# EAGLE design AstroEQ Arduino Mega (EAGLE 6.6.0)
REVISION: V4.8
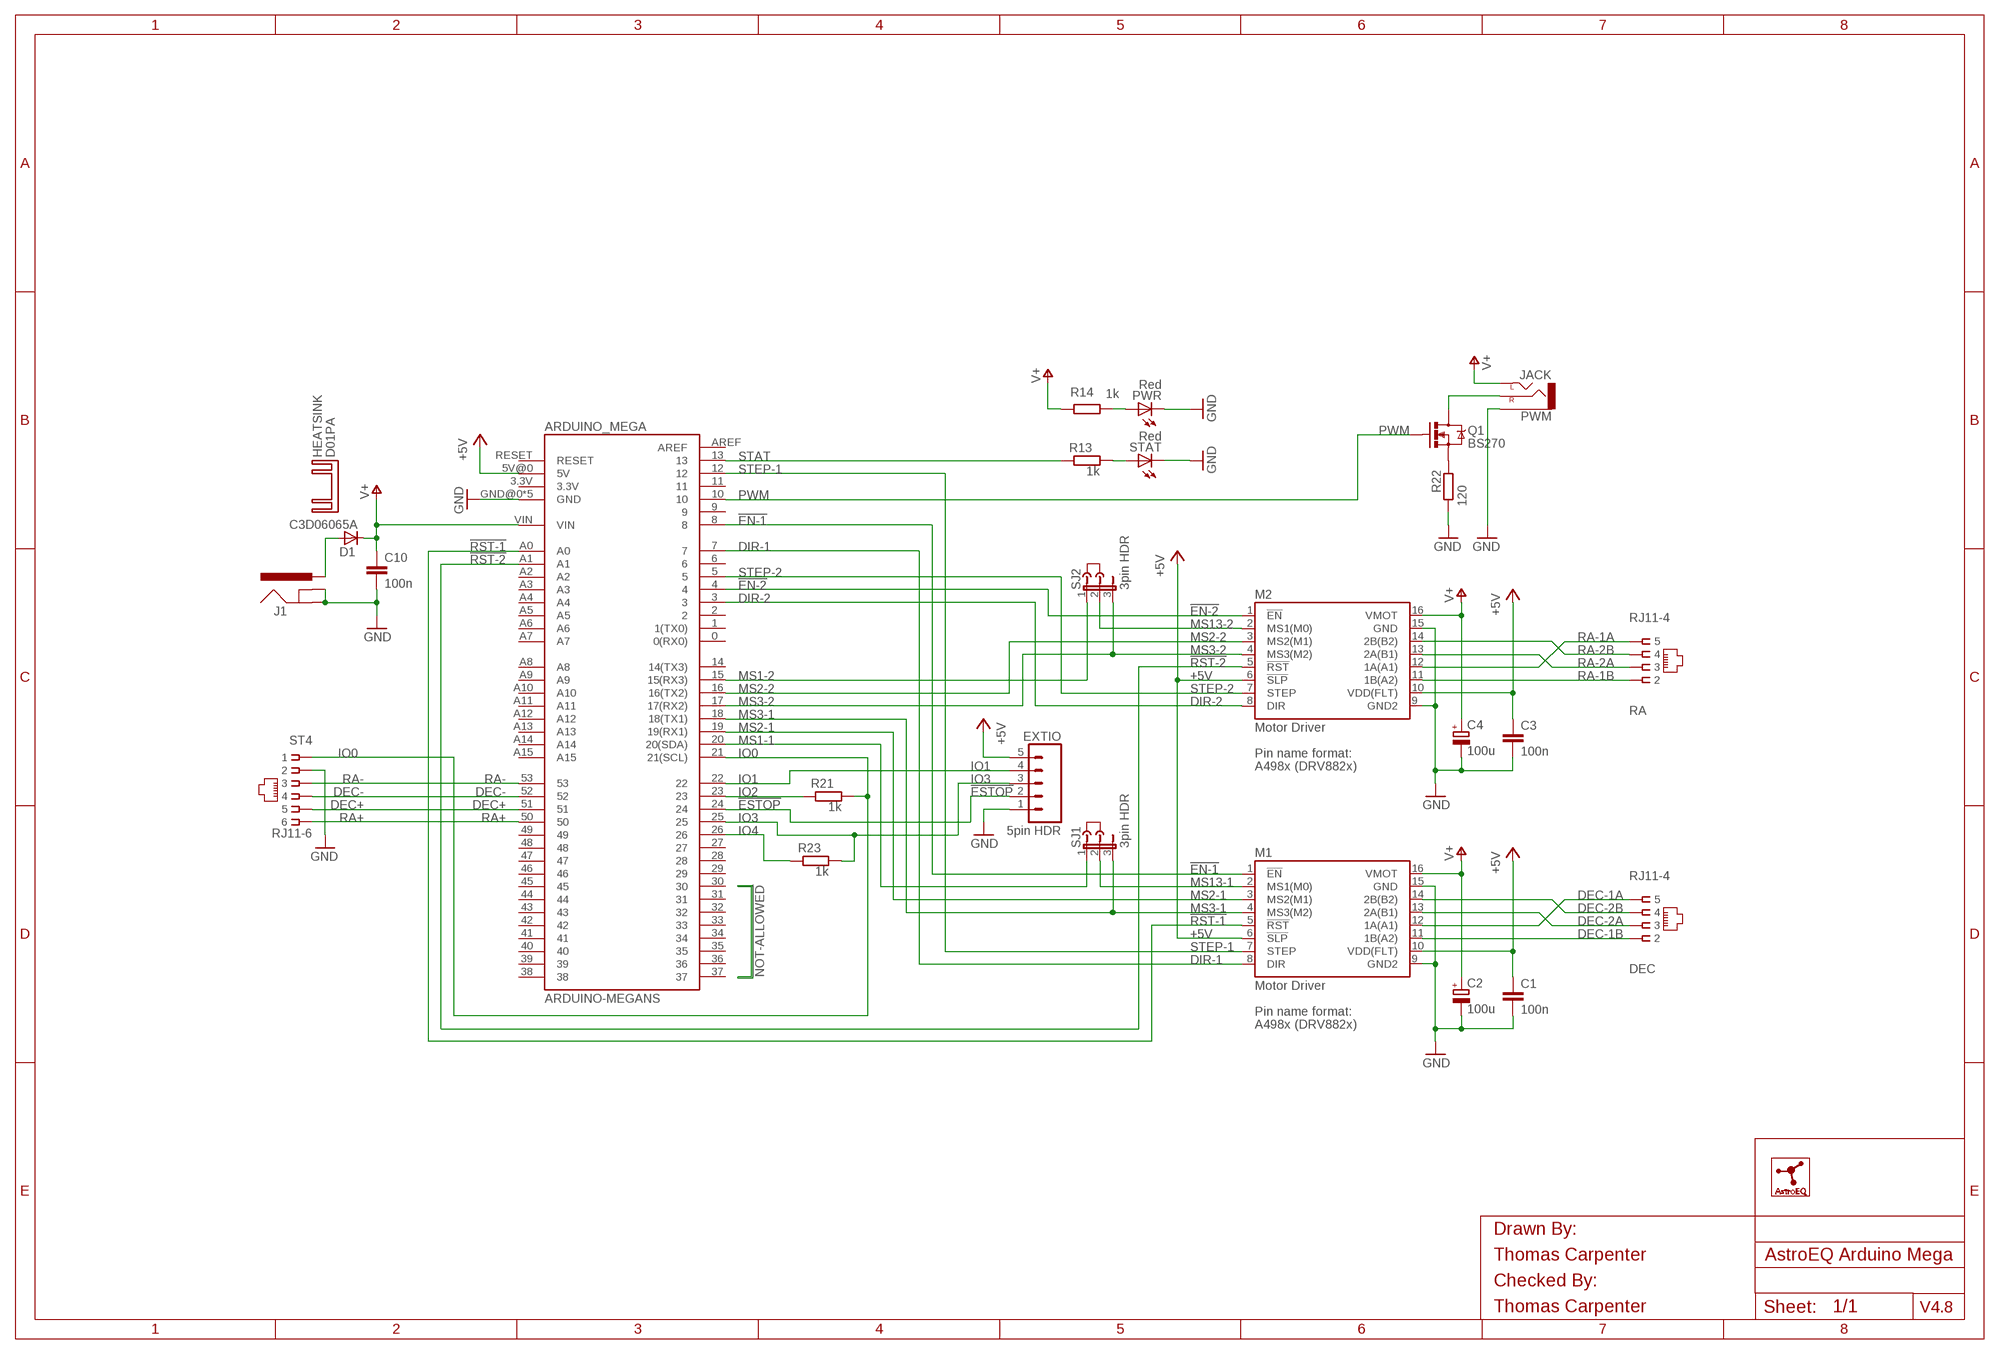
[diagram p0: schematic, sheet 1]
FRAME1 (A3L-LOC): CHECKED_BY: Thomas Carpenter; DRAWN_BY: Thomas Carpenter

## Parts
ARDUINO_MEGA  ARDUINO-MEGANS  [ARDUINO_MEGA_NS]
C1  100n  C-EU025-024X044  [C025-024X044]
C2  100u  CPOL-EUE2.5-7  [E2,5-7]
C3  100n  C-EU025-024X044  [C025-024X044]
C4  100u  CPOL-EUE2.5-7  [E2,5-7]
C10  100n  C-EU025-024X044  [C025-024X044]
D1  C3D06065A  MUR820VERT  [TO220ACS]
DEC  RJ11-4  [RJ11-NO_SHIELD-4]
EXTIO  5pin HDR  M05PTH  [1X05]
HEATSINK  D01PA  [D01PA]
J1  POWER_JACKPTH  [POWER_JACK_PTH]
J2  DNI  JUMPER  [JUMP]
J3  DNI  JUMPER  [JUMP]
LOGO1  ASTROEQ8MM  [ASTROEQ]
M1  Motor Driver  A4983CARRIER  [DIP16-W]
M2  Motor Driver  A4983CARRIER  [DIP16-W]
PWM  JACK  AUDIO-JACKVERT  [AUDIO-JACK-3.5MM-VERT]
PWR  Red  LED3MM  [LED3MM]
Q1  BS270  MOSFET-NCHANNELPTH  [TO-92]
R13  1k  R-EU_0204/5  [0204/5]
R14  1k  R-EU_0204/7  [0204/7]
R21  1k  R-EU_0204/7  [0204/7]
R22  120  R-EU_0204/7  [0204/7]
R23  1k  R-EU_0204/7  [0204/7]
RA  RJ11-4  [RJ11-NO_SHIELD-4]
SJ1  3pin HDR  JP2E  [JP2]
SJ2  3pin HDR  JP2E  [JP2]
ST4  RJ11-6  RJ11-2L-B  [RJ11-NO_SHIELD]
STAT  Red  LED3MM  [LED3MM]

## Nets
!EN-1: ARDUINO_MEGA.8 M1.1(!EN)
!EN-2: ARDUINO_MEGA.4 M2.1(!EN)
!ESTOP: ARDUINO_MEGA.24 EXTIO.2
!RST-1: ARDUINO_MEGA.A0 M1.5(!RST)
!RST-2: ARDUINO_MEGA.A1 M2.5(!RST)
+5V: ARDUINO_MEGA.5V@0(5V) C1.1 C3.1 EXTIO.5 M1.6(!SLP) M1.10(VDD(FLT)) M2.6(!SLP) M2.10(VDD(FLT))
DEC+: ARDUINO_MEGA.51 ST4.5
DEC-: ARDUINO_MEGA.52 ST4.4
DEC-1A: DEC.5 M1.12(1A(A1))
DEC-1B: DEC.2 M1.11(1B(A2))
DEC-2A: DEC.3 M1.13(2A(B1))
DEC-2B: DEC.4 M1.14(2B(B2))
DIR-1: ARDUINO_MEGA.7 M1.8(DIR)
DIR-2: ARDUINO_MEGA.3 M2.8(DIR)
GND: ARDUINO_MEGA.GND@0(GND) ARDUINO_MEGA.GND@1(GND) ARDUINO_MEGA.GND@2(GND) ARDUINO_MEGA.GND@3(GND) ARDUINO_MEGA.GND@4(GND) C1.2 C2.- C3.2 C4.- C10.2 EXTIO.1 J1.GND J1.GNDBREAK M1.9(GND2) M1.15(GND) M2.9(GND2) M2.15(GND) PWM.1(SLEEVE) PWR.K(C) R22.1 ST4.2 STAT.K(C)
IO0: ARDUINO_MEGA.21(21(SCL)) R21.2 ST4.1
IO1: ARDUINO_MEGA.22 EXTIO.4
IO2: ARDUINO_MEGA.23 R21.1
IO3: ARDUINO_MEGA.25 EXTIO.3 R23.2
IO4: ARDUINO_MEGA.26 R23.1
MS1-1: ARDUINO_MEGA.20(20(SDA)) SJ1.1
MS1-2: ARDUINO_MEGA.15(15(RX3)) SJ2.1
MS2-1: ARDUINO_MEGA.19(19(RX1)) M1.3(MS2(M1))
MS2-2: ARDUINO_MEGA.16(16(TX2)) M2.3(MS2(M1))
MS3-1: ARDUINO_MEGA.18(18(TX1)) M1.4(MS3(M2)) SJ1.3
MS3-2: ARDUINO_MEGA.17(17(RX2)) M2.4(MS3(M2)) SJ2.3
MS13-1: M1.2(MS1(M0)) SJ1.2
MS13-2: M2.2(MS1(M0)) SJ2.2
PWM: ARDUINO_MEGA.10 Q1.2(G)
PWM-ILIM: Q1.3(S) R22.2
PWM-OUT: PWM.3(RIGHT) Q1.1(D)
PWRLED: PWR.A R14.2
RA+: ARDUINO_MEGA.50 ST4.6
RA-: ARDUINO_MEGA.53 ST4.3
RA-1A: M2.12(1A(A1)) RA.5
RA-1B: M2.11(1B(A2)) RA.2
RA-2A: M2.13(2A(B1)) RA.3
RA-2B: M2.14(2B(B2)) RA.4
STAT: ARDUINO_MEGA.13 R13.1
STATLED: R13.2 STAT.A
STEP-1: ARDUINO_MEGA.12 M1.7(STEP)
STEP-2: ARDUINO_MEGA.5 M2.7(STEP)
V+: ARDUINO_MEGA.VIN C2.+ C4.+ C10.1 D1.C M1.16(VMOT) M2.16(VMOT) PWM.2(LEFT) R14.1
VIN: D1.A J1.PWR
Unconnected: ARDUINO_MEGA.0(0(RX0)) ARDUINO_MEGA.1(1(TX0)) ARDUINO_MEGA.2 ARDUINO_MEGA.3.3V ARDUINO_MEGA.6 ARDUINO_MEGA.9 ARDUINO_MEGA.11 ARDUINO_MEGA.14(14(TX3)) ARDUINO_MEGA.27 ARDUINO_MEGA.28 ARDUINO_MEGA.29 ARDUINO_MEGA.30 ARDUINO_MEGA.31 ARDUINO_MEGA.32 ARDUINO_MEGA.33 ARDUINO_MEGA.34 ARDUINO_MEGA.35 ARDUINO_MEGA.36 ARDUINO_MEGA.37 ARDUINO_MEGA.38 ARDUINO_MEGA.39 ARDUINO_MEGA.40 ARDUINO_MEGA.41 ARDUINO_MEGA.42 ARDUINO_MEGA.43 ARDUINO_MEGA.44 ARDUINO_MEGA.45 ARDUINO_MEGA.46 ARDUINO_MEGA.47 ARDUINO_MEGA.48 ARDUINO_MEGA.49 ARDUINO_MEGA.A2 ARDUINO_MEGA.A3 ARDUINO_MEGA.A4 ARDUINO_MEGA.A5 ARDUINO_MEGA.A6 ARDUINO_MEGA.A7 ARDUINO_MEGA.A8 ARDUINO_MEGA.A9 ARDUINO_MEGA.A10 ARDUINO_MEGA.A11 ARDUINO_MEGA.A12 ARDUINO_MEGA.A13 ARDUINO_MEGA.A14 ARDUINO_MEGA.A15 ARDUINO_MEGA.AREF ARDUINO_MEGA.RESET

## Library data of the parts
ARDUINO_MEGA = SparkFun:ARDUINO-MEGA: Arduino Mega footprint connections
C1 C3 C10 = resistor:C-EU: CAPACITOR, European symbol; MF: AVX; MPN: SR205C104KAR; OC_FARNELL: 1100367
C2 C4 = resistor:CPOL-EU: POLARIZED CAPACITOR, European symbol; MF: MULTICOMP; MPN: MCGPR25V107M6.3X11; OC_FARNELL: 9451188
D1 = diode:MUR820: DIODE; MF: CREE; MPN: C3D06065A; OC_FARNELL: 1864928
DEC RA = con-tycoelectronics:RJ11-4; MF: MOLEX; MPN: 95501-2641; OC_FARNELL: 1560166
EXTIO = SparkFun:M05: Header 5 Standard 5-pin 0.1" header. Use with straight break away headers (SKU : PRT-00116), right angle break away headers (PRT-00553), swiss pins (PRT-00743), machine pins (PRT-00117), and female headers (PRT-00115). Molex polarized connector foot print use with SKU : PRT-08230 with associated crimp pins and housings.; OC_FARNELL: unknown
HEATSINK = heatsink:D01PA: HEATSINK distributor Schukat
J1 = SparkFun:POWER_JACK: Power Jack This is the standard 5.5mm barrel jack for power. The PTH is the most common, proven, reliable, footprint. All others are experimental. The Slot footprint only works if the mill layer is transmitted to the PCB fab house so be warned. Spark Fun Electronics SKU : PRT-00119. Mating wall wart : TOL-00298 (and others); MF: MULTICOMP; MPN: MJ-179PH; OC_FARNELL: 1737246
J2 J3 = jumper:JUMPER: JUMPER header; MF: 3M; MPN: 969102-0000-DA; OC_FARNELL: 2579814
LOGO1 = CompanyLogos:ASTROEQ
M1 M2 = A4983Carrier:A4983CARRIER; MF: SAMTEC; MPN: CES-116-01-T-S; OC_FARNELL: 1667522
PWM = SparkFun:AUDIO-JACK: 3.5mm Audio Jack Simple 3.5mm common PCB mount audio jack. SKU: PRT-08032; MANUFACTURER: LUMBERG; MF: CLIFF ELECTRONIC COMPONENTS; MPN: 1502 01; OC_FARNELL: 1243242
PWR STAT = led:LED: LED OSRAM: - CHIPLED LG R971, LG N971, LY N971, LG Q971, LY Q971, LO R971, LY R971 LH N974, LH R974 LS Q976, LO Q976, LY Q976 LO Q996 - Hyper CHIPLED LW Q18S LB Q993, LB Q99A, LB R99A - SideLED LS A670, LO A670, LY A670, LG A670, LP A670 LB A673, LV A673, LT A673, LW A673 LH A674 LY A675 LS A676, LA A676, LO A676, LY A676, LW A676 LS A679, LY A679, LG A679 - Hyper Micro SIDELED® LS Y876, LA Y876, LO Y876, LY Y876 LT Y87S - SmartLED LW L88C, LW L88S LB L89C, LB L89S, LG L890 LS L89K, LO L89K, LY L89K LS L896, LA L896, LO L896, LY L896 - TOPLED LS T670, LO T670, LY T670, LG T670, LP T670 LSG T670, LSP T670, LSY T670, LOP T670, LYG T670 LG T671, LOG T671, LSG T671 LB T673, LV T673, LT T673, LW T673 LH T674 LS T676, LA T676, LO T676, LY T676, LB T676, LH T676, LSB T676, LW T676 LB T67C, LV T67C, LT T67C, LS T67K, LO T67K, LY T67K, LW E67C LS E67B, LA E67B, LO E67B, LY E67B, LB E67C, LV E67C, LT E67C LW T67C LS T679, LY T679, LG T679 LS T770, LO T770, LY T770, LG T770, LP T770 LB T773, LV T773, LT T773, LW T773 LH T774 LS E675, LA E675, LY E675, LS T675 LS T776, LA T776, LO T776, LY T776, LB T776 LHGB T686 LT T68C, LB T68C - Hyper Mini TOPLED® LB M676 - Mini TOPLED Santana® LG M470 LS M47K, LO M47K, LY M47K Source: http://www.osram.convergy.de LUXEON: - LUMILED® LXK2-PW12-R00, LXK2-PW12-S00, LXK2-PW14-U00, LXK2-PW14-V00 LXK2-PM12-R00, LXK2-PM12-S00, LXK2-PM14-U00 LXK2-PE12-Q00, LXK2-PE12-R00, LXK2-PE12-S00, LXK2-PE14-T00, LXK2-PE14-U00 LXK2-PB12-K00, LXK2-PB12-L00, LXK2-PB12-M00, LXK2-PB14-N00, LXK2-PB14-P00, LXK2-PB14-Q00 LXK2-PR12-L00, LXK2-PR12-M00, LXK2-PR14-Q00, LXK2-PR14-R00 LXK2-PD12-Q00, LXK2-PD12-R00, LXK2-PD12-S00 LXK2-PH12-R00, LXK2-PH12-S00 LXK2-PL12-P00, LXK2-PL12-Q00, LXK2-PL12-R00 Source: www.luxeon.com KINGBRIGHT: KA-3528ASYC Source: www.kingbright.com; MF: KINGBRIGHT; MPN: L-424HDT; OC_FARNELL: 1142499
Q1 = SparkFun:MOSFET-NCHANNEL; MF: FAIRCHILD SEMICONDUCTOR; MPN: BS270; OC_FARNELL: 1017689
R13 R14 R21 R23 = rcl:R-EU_: RESISTOR, European symbol; MF: MULTICOMP; MPN: MF12 1K; OC_FARNELL: 9342400
R22 = rcl:R-EU_: RESISTOR, European symbol; MF: MULTICOMP; MPN: MF12 120R; OC_FARNELL: 9342516
SJ1 SJ2 = jumper:JP2E: JUMPER; MF: HARWIN; MPN: M20-9990345.; OC_FARNELL: 1022248
ST4 = con-tycoelectronics:RJ11: CORCOM Modular RJ Jacks No Shield Source: www.tycoelectronics.com .. ENG_DS_1654001_1099_RJ_L_0507.pdf; MF: TYCO ELECTRONICS; MPN: RJ11-2L-B; OC_FARNELL: unknown; OC_NEWARK: 83F4463

## Net classes
1 power: width 0.61 mm, drill 0.711 mm, clearance 0.203 mm
2 gnd: width 0.305 mm, drill 0.711 mm, clearance 0.203 mm
3 usbvcc: width 0.508 mm, drill 0.711 mm, clearance 0.203 mm

## Board
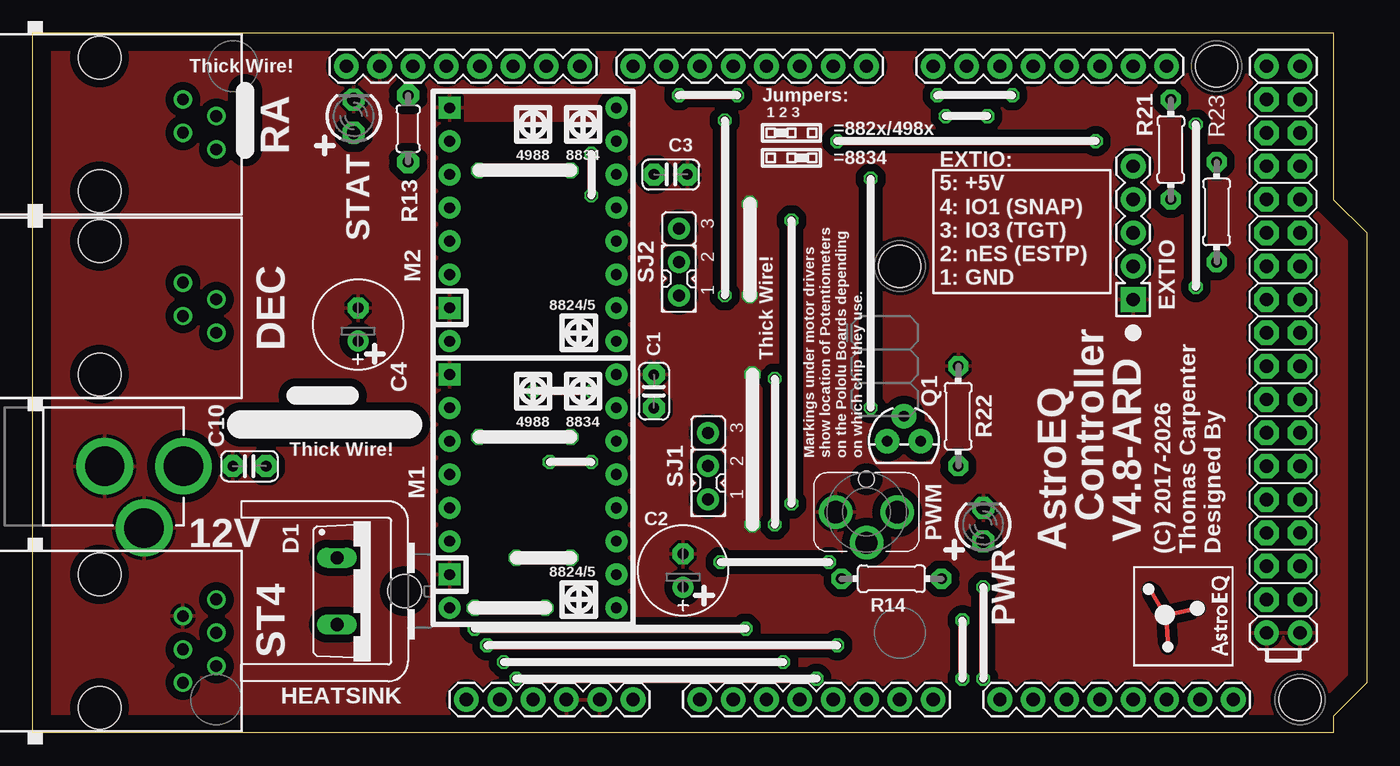
[diagram p1: board, top side]
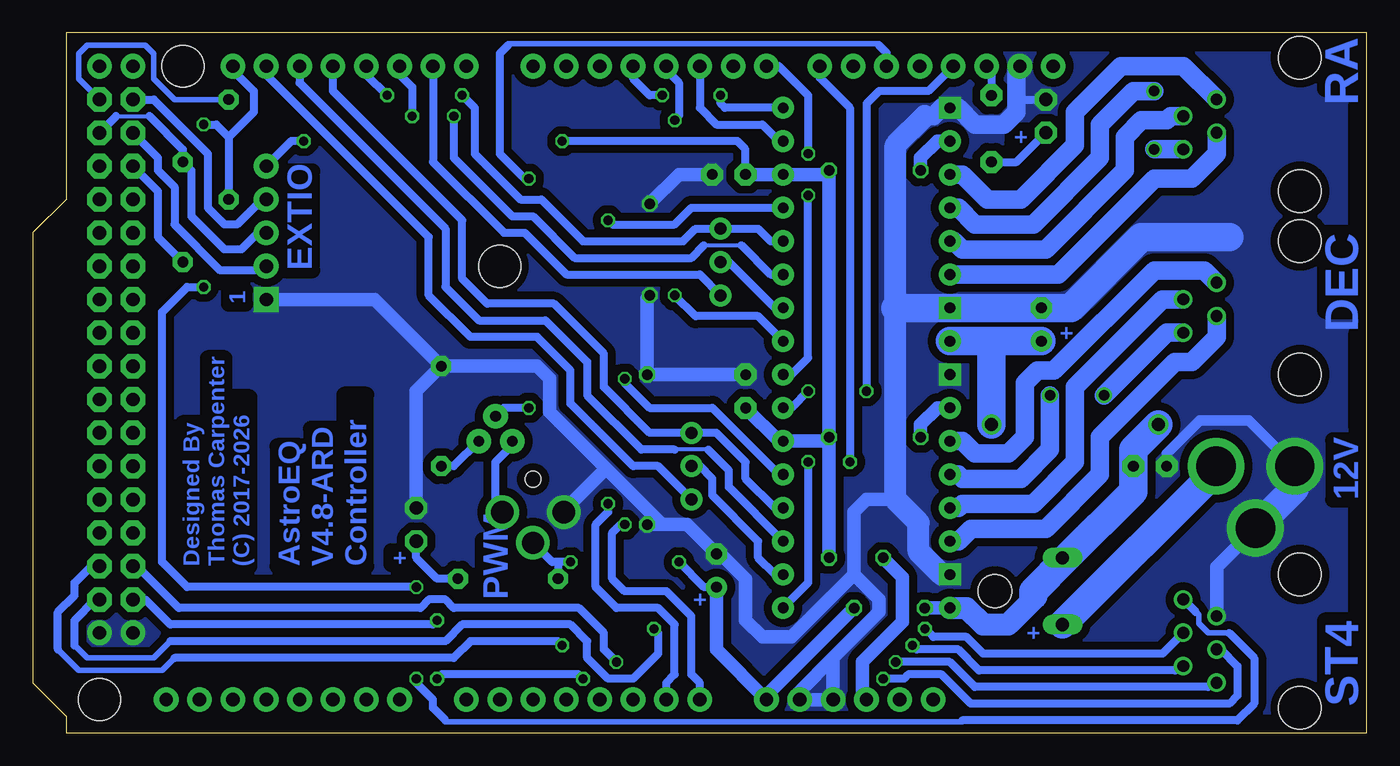
[diagram p2: board, bottom side, seen from below]

Size 101.6 x 53.34 mm. Coordinates in mm from the lower left corner, seen from the top.
Copper layers (1*16): Top 0.035mm / dielectric 1.5mm / Bottom 0.035mm
Design rules "default *": minimum track width 6mil, minimum drill 12mil, track to track 6mil, track to pad 6mil, pad to pad 6mil, via to via 6mil, smd to smd 0mil, copper to edge 12mil, drill to drill 10mil, minimum pad ring 10mil, minimum via ring 6mil, stop-mask expansion 2mil, vias tented up to drill 1mm, thermal gap 10mil
Holes 3.2 mm at 90.17,50.8 66.04,35.56 96.52,2.54
tRestrict: 8 lines
bRestrict: 10 lines

### Footprints (pad centres in the part's own frame; a part is rotated, then mirrored left to right if it is on the bottom)
ARDUINO_MEGA_NS = drill 1.016 pad 1.88: 0 63.5,50.8; 1 60.96,50.8; 2 58.42,50.8; 3 55.88,50.8; 3.3V 35.56,2.54; 4 53.34,50.8; 5 50.8,50.8; 5V@0 38.1,2.54; 5V@1 93.98,50.8; 5V@2 96.52,50.8; 6 48.26,50.8; 7 45.72,50.8; 8 41.656,50.8; 9 39.116,50.8; 10 36.576,50.8; 11 34.036,50.8; 12 31.496,50.8; 13 28.956,50.8; 14 68.58,50.8; 15 71.12,50.8; 16 73.66,50.8; 17 76.2,50.8; 18 78.74,50.8; 19 81.28,50.8; 20 83.82,50.8; 21 86.36,50.8; A0 50.8,2.54; A1 53.34,2.54; A2 55.88,2.54; A3 58.42,2.54; A4 60.96,2.54; A5 63.5,2.54; A6 66.04,2.54; A7 68.58,2.54; A8 73.66,2.54; A9 76.2,2.54; A10 78.74,2.54; A11 81.28,2.54; A12 83.82,2.54; A13 86.36,2.54; A14 88.9,2.54; A15 91.44,2.54; AREF 23.876,50.8; GND@0 40.64,2.54; GND@1 43.18,2.54; GND@2 93.98,7.62; GND@3 96.52,7.62; GND@4 26.416,50.8; RESET 33.02,2.54; VIN 45.72,2.54 | drill 1.016 pad 1.88 octagon: 22 93.98,48.26; 23 96.52,48.26; 24 93.98,45.72; 25 96.52,45.72; 26 93.98,43.18; 27 96.52,43.18; 28 93.98,40.64; 29 96.52,40.64; 30 93.98,38.1; 31 96.52,38.1; 32 93.98,35.56; 33 96.52,35.56; 34 93.98,33.02; 35 96.52,33.02; 36 93.98,30.48; 37 96.52,30.48; 38 93.98,27.94; 39 96.52,27.94; 40 93.98,25.4; 41 96.52,25.4; 42 93.98,22.86; 43 96.52,22.86; 44 93.98,20.32; 45 96.52,20.32; 46 93.98,17.78; 47 96.52,17.78; 48 93.98,15.24; 49 96.52,15.24; 50 93.98,12.7; 51 96.52,12.7; 52 93.98,10.16; 53 96.52,10.16
C025-024X044 = drill 0.813 pad 1.676 octagon: 1 -1.27,0; 2 1.27,0
E2,5-7 = drill 0.813 pad 1.6: + -1.27,0 | drill 0.813 pad 1.6 octagon: - 1.27,0
TO220ACS = drill 1.016 long: A 2.54,-2.54; C -2.54,-2.54
RJ11-NO_SHIELD-4 = drill 0.9 pad 1.4: 2 -1.905,6.35; 3 -0.635,8.89; 4 0.635,6.35; 5 1.905,8.89 | hole 3.251: -5.08,0; 5.08,0
1X05 = drill 1.016 pad 1.88 square: 1 -5.08,0 | drill 1.016 pad 1.88: 2 -2.54,0; 3 0,0; 4 2.54,0; 5 5.08,0
D01PA = hole 2.54: 0,-1.016
POWER_JACK_PTH = drill 2.997 pad 4.318: GND 0,7.7; GNDBREAK 4.7,10.7; PWR 0,13.7
DIP16-W = drill 0.813 pad 1.676: 1 -8.89,-6.35; 2 -6.35,-6.35; 3 -3.81,-6.35; 4 -1.27,-6.35; 5 1.27,-6.35; 6 3.81,-6.35; 7 6.35,-6.35; 8 8.89,-6.35; 10 6.35,6.35; 11 3.81,6.35; 12 1.27,6.35; 13 -1.27,6.35; 14 -3.81,6.35; 16 -8.89,6.35 | drill 0.813 pad 1.676 square: 9 8.89,6.35; 15 -6.35,6.35
AUDIO-JACK-3.5MM-VERT = drill 1.7: 1 2.35,0; 2 0,2.35; 3 -2.35,0 | hole 1.2: 0,-2.5
LED3MM = drill 1 pad 1.676 octagon: A -1.27,0; K 1.27,0
TO-92 = drill 0.813 pad 1.88: 1 -1.27,0; 2 0,1.905; 3 1.27,0
0204/5 = drill 0.813 pad 1.676 octagon: 1 -2.54,0; 2 2.54,0
0204/7 = drill 0.813 pad 1.524 octagon: 1 -3.81,0; 2 3.81,0
JP2 = drill 0.914 pad 1.676: 1 -2.54,0; 2 0,0; 3 2.54,0
RJ11-NO_SHIELD = drill 0.9 pad 1.4: 1 -3.175,8.89; 2 -1.905,6.35; 3 -0.635,8.89; 4 0.635,6.35; 5 1.905,8.89; 6 3.175,6.35 | hole 3.251: -5.08,0; 5.08,0

### Placement (x,y rotation side)
ARDUINO_MEGA  0,0 0 top
C1  47.31,26.02 90 top
C2  49.53,12.37 90 top
C3  48.59,42.55 0 top
C4  24.77,31.11 90 top
C10  16.5,20.32 180 top
D1  25.72,10.79 270 top
DEC  5.08,32.4 270 top
EXTIO  83.82,38.1 90 top
HEATSINK  27.3,10.79 90 top
J1  -2.22,20.31 270 top
J2  49.21,34.61 180 top
J3  51.44,19.05 180 top
LOGO1  91.44,5.08 90 top
M1  38.1,18.41 90 top
M2  38.1,38.73 90 top
PWM  63.5,16.83 180 top
PWR  72.39,15.88 90 top
Q1  66.36,22.23 0 top
R13  28.59,46.04 270 top
R14  65.41,11.75 0 top
R21  86.68,44.45 270 top
R22  70.48,24.13 270 top
R23  90.17,39.69 90 top
RA  5.08,46.37 270 top
SJ1  51.44,20.32 90 top
SJ2  49.21,35.88 90 top
ST4  5.08,7 270 top
STAT  24.45,46.99 90 top

### Tracks (layer width: path | path; a pad name or v marks a point on that pad's centre or on a via)
!EN-1  (via drill 0.7)
  Top 0.61: v39.37,20.64 v42.55,20.64
  Bottom 0.61: ARDUINO_MEGA.8 41.66,49.91 39.37,47.62 v39.37,20.64 | v42.55,20.64 42.55,11.43 M1.1
!EN-2  (via drill 0.7)
  Top 0.61: v52.7,33.34 v52.7,46.67
  Bottom 0.61: ARDUINO_MEGA.4 53.34,50.48 52.39,49.53 52.39,46.99 v52.7,46.67 | M2.1 46.35,31.75 51.12,31.75 v52.7,33.34
!ESTOP
  Bottom 0.61: ARDUINO_MEGA.24 92.08,43.81 92.08,42.86 90.81,41.59 90.81,38.73 87.31,35.24 84.14,35.24 EXTIO.2
!RST-1  (via drill 0.7)
  Top 0.61: v56.52,15.88 v56.52,26.99
  Bottom 0.61: ARDUINO_MEGA.A0 50.8,3.81 51.44,4.45 51.44,8.89 53.34,10.79 56.52,10.79 57.47,11.75 57.47,15.24 56.83,15.88 v56.52,15.88 | v56.52,26.99 56.52,26.67 54.61,24.77 49.85,24.77 44.77,19.68 M1.5
!RST-2  (via drill 0.7)
  Top 0.61: v57.78,17.46 v57.78,39.05
  Bottom 0.61: ARDUINO_MEGA.A1 53.34,3.81 52.7,4.45 52.7,8.26 53.98,9.53 57.15,9.53 58.74,11.11 58.74,15.88 57.78,16.83 v57.78,17.46 | v57.78,39.05 57.47,38.73 52.7,38.73 51.44,40.01 M2.5
+5V  (via drill 0.7, 0.8)
  Top 0.61: v61.28,45.09 v80.96,45.09
  Top 1.016: v33.97,22.54 v40.96,22.54 | v33.97,42.86 v40.96,42.86 | v36.83,13.34 v40.96,13.34
  Bottom 0.61: C3.1 47.32,44.46 47.94,45.09 v61.28,45.09 | v80.96,45.09 81.92,45.09 EXTIO.5
  Bottom 1.016: M1.10 32.7,24.77 33.97,23.5 v33.97,22.54 | 40.96,22.23 v40.96,22.54 40.96,42.55 | M2.10 32.7,45.09 33.97,43.81 v33.97,42.86 | v40.96,42.86 40.96,42.55 | 40.96,42.55 M2.6 C3.1 | 40.96,22.23 M1.6 44.78,22.23 C1.1 | v36.83,13.34 35.36,11.87 35.36,8.46 38.42,5.4 38.42,2.86 ARDUINO_MEGA.5V@0 | v40.96,13.34 40.96,22.23
DEC+  (via drill 0.7)
  Top 0.61: v34.61,6.67 v61.28,6.67
  Bottom 0.406: 90.81,5.71 91.76,4.76 98.11,4.76 99.69,6.35
  Bottom 0.61: ST4.5 14.29,5.08 14.61,4.76 29.53,4.76 31.11,6.35 34.29,6.35 v34.61,6.67 | v61.28,6.67 61.59,6.99 68.26,6.99 69.53,5.71 90.81,5.71 | 99.69,6.35 99.69,9.21 98.42,10.48 98.42,11.43 97.16,12.7 ARDUINO_MEGA.51
DEC-  (via drill 0.7)
  Top 0.61: v36.83,4.13 v59.69,4.13 | v70.8,4.13 v70.8,8.57
  Bottom 0.61: ST4.4 11.11,6.35 9.84,5.08 9.84,2.86 10.48,2.22 30.16,2.22 32.38,4.45 34.92,4.45 35.24,4.13 v36.83,4.13 | v59.69,4.13 60.01,4.45 70.48,4.45 v70.8,4.13 | v70.8,8.57 71.12,8.26 91.12,8.26 93.03,10.16 ARDUINO_MEGA.52
DEC-1A  (via drill 0.8)
  Top 1.422: v24.13,25.72 v20,25.72
  Bottom 1.422: v24.13,25.72 24.13,21.59 26.35,19.37 30.8,19.37 31.11,19.68 M1.12 | v20,25.72 15.23,30.49 DEC.5
DEC-1B
  Bottom 1.422: DEC.2 12.38,35.24 16.19,35.24 23.81,27.62 25.08,27.62 26.04,26.67 26.04,22.54 27.3,21.27 29.84,21.27 30.8,22.23 M1.11
DEC-2A
  Bottom 1.422: M1.13 31.11,17.14 30.8,17.46 25.4,17.46 22.23,20.64 22.23,26.35 15.55,33.03 DEC.3
DEC-2B
  Bottom 1.422: DEC.4 11.43,30.16 13.34,28.26 14.61,28.26 20.32,22.54 20.32,19.68 24.45,15.56 30.16,15.56 31.11,14.61 M1.14
DIR-1  (via drill 0.7)
  Top 0.61: v42.55,40.96 v42.55,44.13
  Bottom 0.61: ARDUINO_MEGA.7 44.77,50.8 42.55,48.58 v42.55,44.13 | M1.8 43.81,27.3 42.55,28.57 v42.55,40.96
DIR-2  (via drill 0.7)
  Top 0.61: v49.21,48.58 v53.66,48.58
  Bottom 0.61: M2.8 48.9,47.62 49.21,47.94 v49.21,48.58 | v53.66,48.58 54.61,48.58 55.88,49.85 ARDUINO_MEGA.3
GND  (via drill 0.8)
  Top 1.016: v54.81,15.88 v54.81,27.3 | v54.61,33.34 v54.61,40.32
  Bottom 0.61: ST4.2 11.75,8.89 | 26.67,48.26 STAT.K
  Bottom 0.813: C10.2 15.23,21.28 12.7,23.81 8.98,23.81 J1.GND
  Bottom 1.016: 40.64,5.71 ARDUINO_MEGA.GND@0 ARDUINO_MEGA.GND@1 43.18,3.17 40.64,5.71 | 40.64,5.71 37.15,9.21 37.15,10.16 39.05,12.06 | 39.05,12.06 39.05,16.83 38.1,17.78 35.88,17.78 | 39.05,12.06 43.81,7.3 46.04,7.3 47.31,8.57 47.31,11.75 49.2,13.64 C2.- 51.76,15.88 53.66,15.88 | 53.66,15.88 57.94,20.16 | 57.94,20.16 62.23,24.45 62.23,26.99 63.18,27.94 R22.1 | R22.1 72.39,26.04 PWR.K | v54.61,40.32 52.39,42.55 C3.2 | v54.81,15.88 53.66,15.88 | v54.61,33.34 54.81,33.14 v54.81,27.3 47.31,27.3 | R22.1 75.56,33.02 EXTIO.1 | ST4.2 11.43,12.66 J1.GNDBREAK | PWM.1 61.15,16.95 57.94,20.16
  Bottom 1.422: 33.66,46.99 33.02,46.99 32.38,47.62 M2.9 31.11,47.62 29.84,46.35 27.62,46.35 26.67,47.31 26.67,48.26 26.67,50.55 ARDUINO_MEGA.GND@4
  Bottom 1.676: M1.15 32.38,12.06 34.13,13.81 34.13,16.03 35.88,17.78 35.88,32.38 35.88,44.77 33.66,46.99
  Bottom 2.184: J1.GND 5.48,18.61 J1.GNDBREAK | 10.48,37.78 17.14,37.78 22.54,32.38 M2.15 35.88,32.38
  pour Bottom (isolate 0.61, no thermals): -0.64,-0.64 102.87,-0.64 102.87,53.98 -0.64,53.98
  pour Top (isolate 0.61): -0.64,-0.64 102.87,-0.64 102.87,53.98 31.75,53.98 31.75,46.67 44.13,46.67 44.13,8.26 31.75,8.26 31.75,53.98 -0.64,53.98
IO0  (via drill 0.7)
  Top 0.61: v72.39,4.13 v72.39,11.11 | v88.58,33.97 v88.58,46.35
  Bottom 0.4: 13.02,9.22 13.02,9.21 12.8,8.99 12.8,8.36 12.06,7.62 10.48,7.62
  Bottom 0.406: 30.8,0.95 30.8,0.85 70.17,0.85 70.17,0.95
  Bottom 0.61: ARDUINO_MEGA.21 86.36,50.48 84.77,48.9 84.77,47.31 86.68,45.4 | 86.68,45.4 R21.2 | ST4.1 13.02,9.22 | 10.48,7.62 8.57,5.71 8.57,2.22 9.84,0.95 30.8,0.95 | 70.17,0.95 71.12,1.91 71.12,2.54 72.39,3.81 v72.39,4.13 | v72.39,11.11 89.85,11.11 91.76,13.02 91.76,32.07 89.85,33.97 v88.58,33.97 | v88.58,46.35 87.63,46.35 86.68,45.4
IO1
  Bottom 0.61: ARDUINO_MEGA.22 92.39,48.26 88.27,44.13 88.27,40.01 87,38.73 86.04,38.73 84.14,40.64 EXTIO.4
IO2
  Bottom 0.406: ARDUINO_MEGA.23 98.11,49.85 98.11,51.75 97.47,52.39 93.03,52.39 92.39,51.75 92.39,49.85 90.81,48.26 R21.1
IO3
  Bottom 0.3: 95.25,46.99 92.71,46.99
  Bottom 0.61: ARDUINO_MEGA.25 95.25,46.99 | 92.71,46.99 90.17,44.45 R23.2 89.53,42.86 89.53,39.37 87,36.83 85.72,36.83 84.45,38.1 EXTIO.3
IO4
  Bottom 0.61: ARDUINO_MEGA.26 92.08,41.27 92.08,37.78 R23.1
MS1-1
  Bottom 0.61: SJ1.1 53.98,20.32 55.88,20.32 60.64,25.08 60.64,27.62 63.18,30.16 68.26,30.16 71.44,33.34 71.44,37.78 83.82,50.16 ARDUINO_MEGA.20
MS1-2
  Bottom 0.61: ARDUINO_MEGA.15 71.12,43.5 65.72,38.1 64.14,38.1 60.96,34.92 50.8,34.92 SJ2.1
MS2-1
  Bottom 0.3: 50.16,21.59 52.7,21.59
  Bottom 0.61: M1.3 48.58,18.73 48.58,20 50.16,21.59 | 52.7,21.59 55.24,21.59 59.37,25.72 59.37,28.26 62.55,31.43 67.63,31.43 70.17,33.97 70.17,38.42 81.28,49.53 ARDUINO_MEGA.19
MS2-2  (via drill 0.7)
  Top 0.61: v72.71,46.99 v69.53,46.99
  Bottom 0.3: 50.48,37.15 47.62,37.15
  Bottom 0.61: ARDUINO_MEGA.16 73.66,50.16 72.71,49.21 v72.71,46.99 | v69.53,46.99 69.53,43.81 65.09,39.37 63.5,39.37 60.33,36.2 51.44,36.2 50.48,37.15 | 47.62,37.15 45.4,34.92 M2.3
MS3-1
  Bottom 0.61: M1.4 45.09,17.14 47.31,19.37 47.31,20.64 49.53,22.86 SJ1.3 54.61,22.86 58.1,26.35 58.1,28.89 61.91,32.7 66.99,32.7 68.9,34.61 68.9,39.05 78.74,48.9 ARDUINO_MEGA.18
MS3-2  (via drill 0.7)
  Top 0.61: v74.61,48.58 v68.9,48.58
  Bottom 0.61: ARDUINO_MEGA.17 76.2,50.16 v74.61,48.58 | v68.9,48.58 67.94,47.62 67.94,44.13 64.45,40.64 62.87,40.64 59.69,37.47 52.07,37.47 51.12,38.42 SJ2.3 46.35,38.42 45.4,37.47 M2.4
MS13-1
  Bottom 0.61: M1.2 45.09,12.06 46.35,13.34 46.35,14.61 49.85,18.1 49.85,19.37 50.8,20.32 SJ1.2
MS13-2
  Bottom 0.61: M2.2 45.09,32.38 48.58,35.88 SJ2.2
PWM  (via drill 0.7)
  Top 0.61: v63.82,42.23 v63.82,24.77
  Bottom 0.406: 37.15,52.39 37.15,52.49 65.41,52.49 65.41,52.39
  Bottom 0.61: ARDUINO_MEGA.10 36.58,51.82 37.15,52.39 | 65.41,52.39 66.04,51.75 66.04,44.13 64.14,42.23 v63.82,42.23 | v63.82,24.77 65.72,24.77 Q1.2
PWM-ILIM
  Bottom 0.61: Q1.3 69.53,20.32 R22.2
PWM-OUT
  Bottom 0.61: PWM.3 66.36,17.34 66.36,20.64 65.09,21.91 Q1.1
PWRLED
  Bottom 0.61: R14.2 70.8,11.75 72.39,13.34 PWR.A
RA+  (via drill 0.7)
  Top 0.61: v35.88,5.4 v57.15,5.4
  Bottom 0.61: ST4.6 11.75,3.81 12.06,3.49 29.84,3.49 31.75,5.4 v35.88,5.4 | v57.15,5.4 58.1,6.35 58.1,7.62 60.01,9.53 69.53,9.53 70.17,10.16 71.44,10.16 72.07,9.53 90.49,9.53 93.66,12.7 ARDUINO_MEGA.50
RA-  (via drill 0.7)
  Top 0.61: v33.66,7.94 v54.29,7.94
  Bottom 0.406: 91.12,6.99 92.39,5.71 97.47,5.71 98.42,6.67
  Bottom 0.61: ST4.3 15.56,6.03 29.21,6.03 30.48,7.3 33.02,7.3 v33.66,7.94 | v54.29,7.94 53.98,7.62 53.98,6.03 55.88,4.13 57.78,4.13 59.37,5.71 59.37,6.99 60.64,8.26 68.9,8.26 70.17,6.99 91.12,6.99 | 98.42,6.67 98.42,8.57 96.84,10.16 ARDUINO_MEGA.53
RA-1A  (via drill 0.8)
  Top 1.422: v16.19,48.9 v16.19,44.46
  Bottom 1.422: v16.19,44.46 RA.5 | v16.19,48.9 17.78,48.9 20.32,46.35 20.32,43.81 25.4,38.73 29.84,38.73 31.11,40.01 M2.12
RA-1B
  Bottom 1.422: RA.2 13.96,50.8 18.73,50.8 22.23,47.31 22.23,44.77 26.35,40.64 28.89,40.64 30.8,42.55 M2.11
RA-2A
  Bottom 1.422: RA.3 14.92,46.99 15.24,46.67 17.14,46.67 18.41,45.4 18.41,42.86 24.45,36.83 30.8,36.83 31.43,37.47 M2.13
RA-2B
  Bottom 1.422: M2.14 23.5,34.92 16.19,42.23 13.34,42.23 11.43,44.13 RA.4
STAT
  Bottom 0.61: ARDUINO_MEGA.13 28.59,50.43 R13.1
STATLED
  Bottom 0.61: R13.2 26.67,43.5 STAT.A
STEP-1  (via drill 0.7)
  Top 0.61: v38.1,26.04 v42.55,26.04
  Bottom 0.61: v38.1,26.04 38.1,47.94 37.15,48.9 33.4,48.9 ARDUINO_MEGA.12 | v42.55,26.04 43.81,24.77 M1.7
STEP-2
  Bottom 0.61: ARDUINO_MEGA.5 50.8,47.62 49.53,46.35 46.04,46.35 44.77,45.09 M2.7
V+  (via drill 0.7, 0.8, 1)
  Top 0.61: v52.39,13.02 v60.64,13.02
  Top 1.016: v33.66,9.53 v39.05,9.53
  Top 2.184: v15.88,23.5 v28.57,23.5
  Bottom 0.61: C2.+ 50.47,11.1 v52.39,13.02 | v60.64,13.02 61.59,13.02 | 61.59,13.02 R14.1 | 61.59,13.02 62.04,13.02 PWM.2
  Bottom 0.813: C10.1
  Bottom 1.016: v39.05,9.53 45.72,2.86 ARDUINO_MEGA.VIN 49.53,6.35 C2.+ | M1.16 v33.66,9.53
  Bottom 1.676: M1.16 30.48,9.53 29.21,8.26 27.3,8.26 25.4,10.16 25.4,10.48 | 22.86,13.34 D1.C
  Bottom 2.184: v15.88,23.5 17.78,21.59 C10.1 17.78,18.41 22.86,13.34 25.4,10.79 25.4,10.48 | v28.57,23.5 28.57,29.84 | 28.57,29.84 M2.16 | 28.57,29.84 C4.+
VIN
  Bottom 2.184: 11.16,20.27 11.27,20.16 | 11.27,20.16 D1.A | J1.PWR 11.42,20.31 11.27,20.16

### Text on the board
Bottom: RA | + | DEC | EXTIO | 1 | + | 12V | + | Controller | V4.8-ARD | AstroEQ | (C) 2017-2026 | Thomas Carpenter | Designed By | + | PWM | ST4 | +
tPlace: Thick Wire! | Jumpers: | 1 2 3 | =882x/498x | =8834 | Thick Wire! | Thick Wire! | Markings under motor drivers / show location of Potentiometers / on the Pololu Boards depending / on which chip they use.
tNames: EXTIO: / 5: +5V / 4: IO1 (SNAP) / 3: IO3 (TGT) / 2: nES (ESTP) / 1: GND | Controller | V4.8-ARD | AstroEQ | 12V | (C) 2017-2026 | Thomas Carpenter | Designed By
Reference: This board design is for Arduino Mega based AstroEQ controllers. | It is a 2 Layer board designed to be sent for manufacture. The AstroEQ-ARD-Gerber.zip file contains the required gerber files. | It can also be home etched as a 1 Layer board, using only the bottom, and making sure all white lines are connected with wires. | Make sure to show the ground plane. Type 'ratsnest' and press enter. | For printing the silkscreen to paper, you should only have TNames, TPlace and Dimension layers visible.